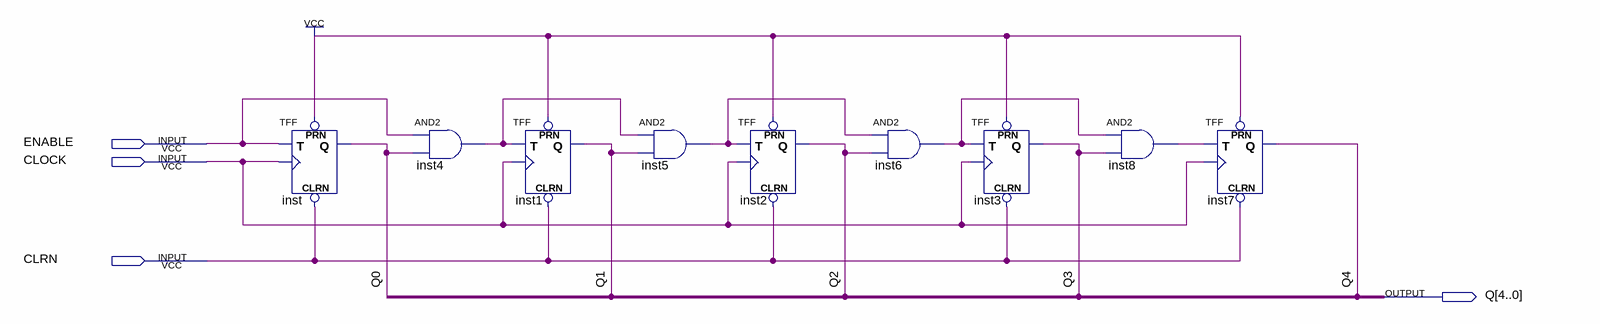
[diagram p0: schematic sheet]
// Quartus schematic lab10step2b.bdf as structural Verilog: 9 symbols, 4 pins
module lab10step2b (
  input  ENABLE,
  input  CLOCK,
  input  CLRN,
  output [4:0] Q
);

  wire inst4_out, inst5_out, inst6_out, inst8_out;

  TFF inst (.PRN(1'b1), .CLRN(CLRN), .T(ENABLE), .CLK(CLOCK), .Q(Q[0]));
  and inst4 (inst4_out, ENABLE, Q[0]);
  TFF inst1 (.PRN(1'b1), .CLRN(CLRN), .T(inst4_out), .CLK(CLOCK), .Q(Q[1]));
  and inst5 (inst5_out, inst4_out, Q[1]);
  TFF inst2 (.PRN(1'b1), .CLRN(CLRN), .T(inst5_out), .CLK(CLOCK), .Q(Q[2]));
  and inst6 (inst6_out, inst5_out, Q[2]);
  TFF inst3 (.PRN(1'b1), .CLRN(CLRN), .T(inst6_out), .CLK(CLOCK), .Q(Q[3]));
  and inst8 (inst8_out, inst6_out, Q[3]);
  TFF inst7 (.PRN(1'b1), .CLRN(CLRN), .T(inst8_out), .CLK(CLOCK), .Q(Q[4]));
endmodule
